# Altium project PUA.PrjPcb (part 10 of 14)

## Sheet Server_CPU_Power.SchDoc
size D
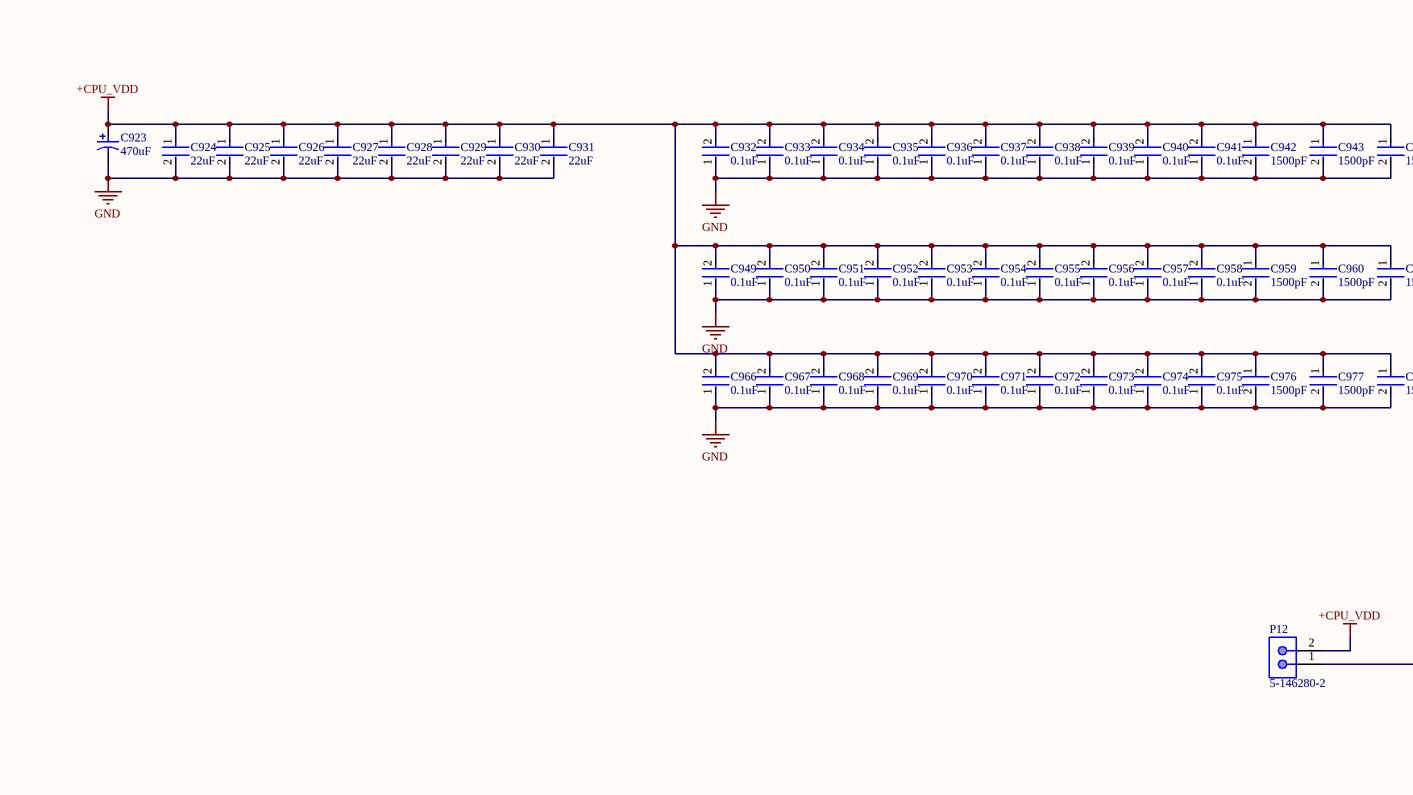
[diagram p45: Server_CPU_Power.SchDoc, top left]
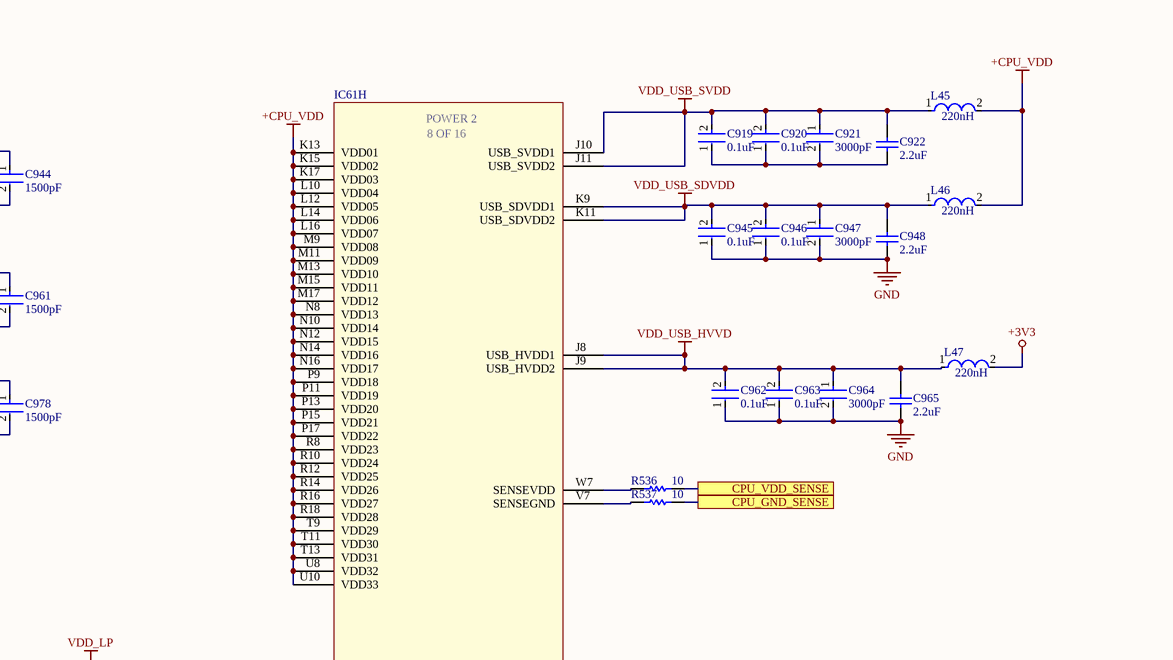
[diagram p46: Server_CPU_Power.SchDoc, top right]
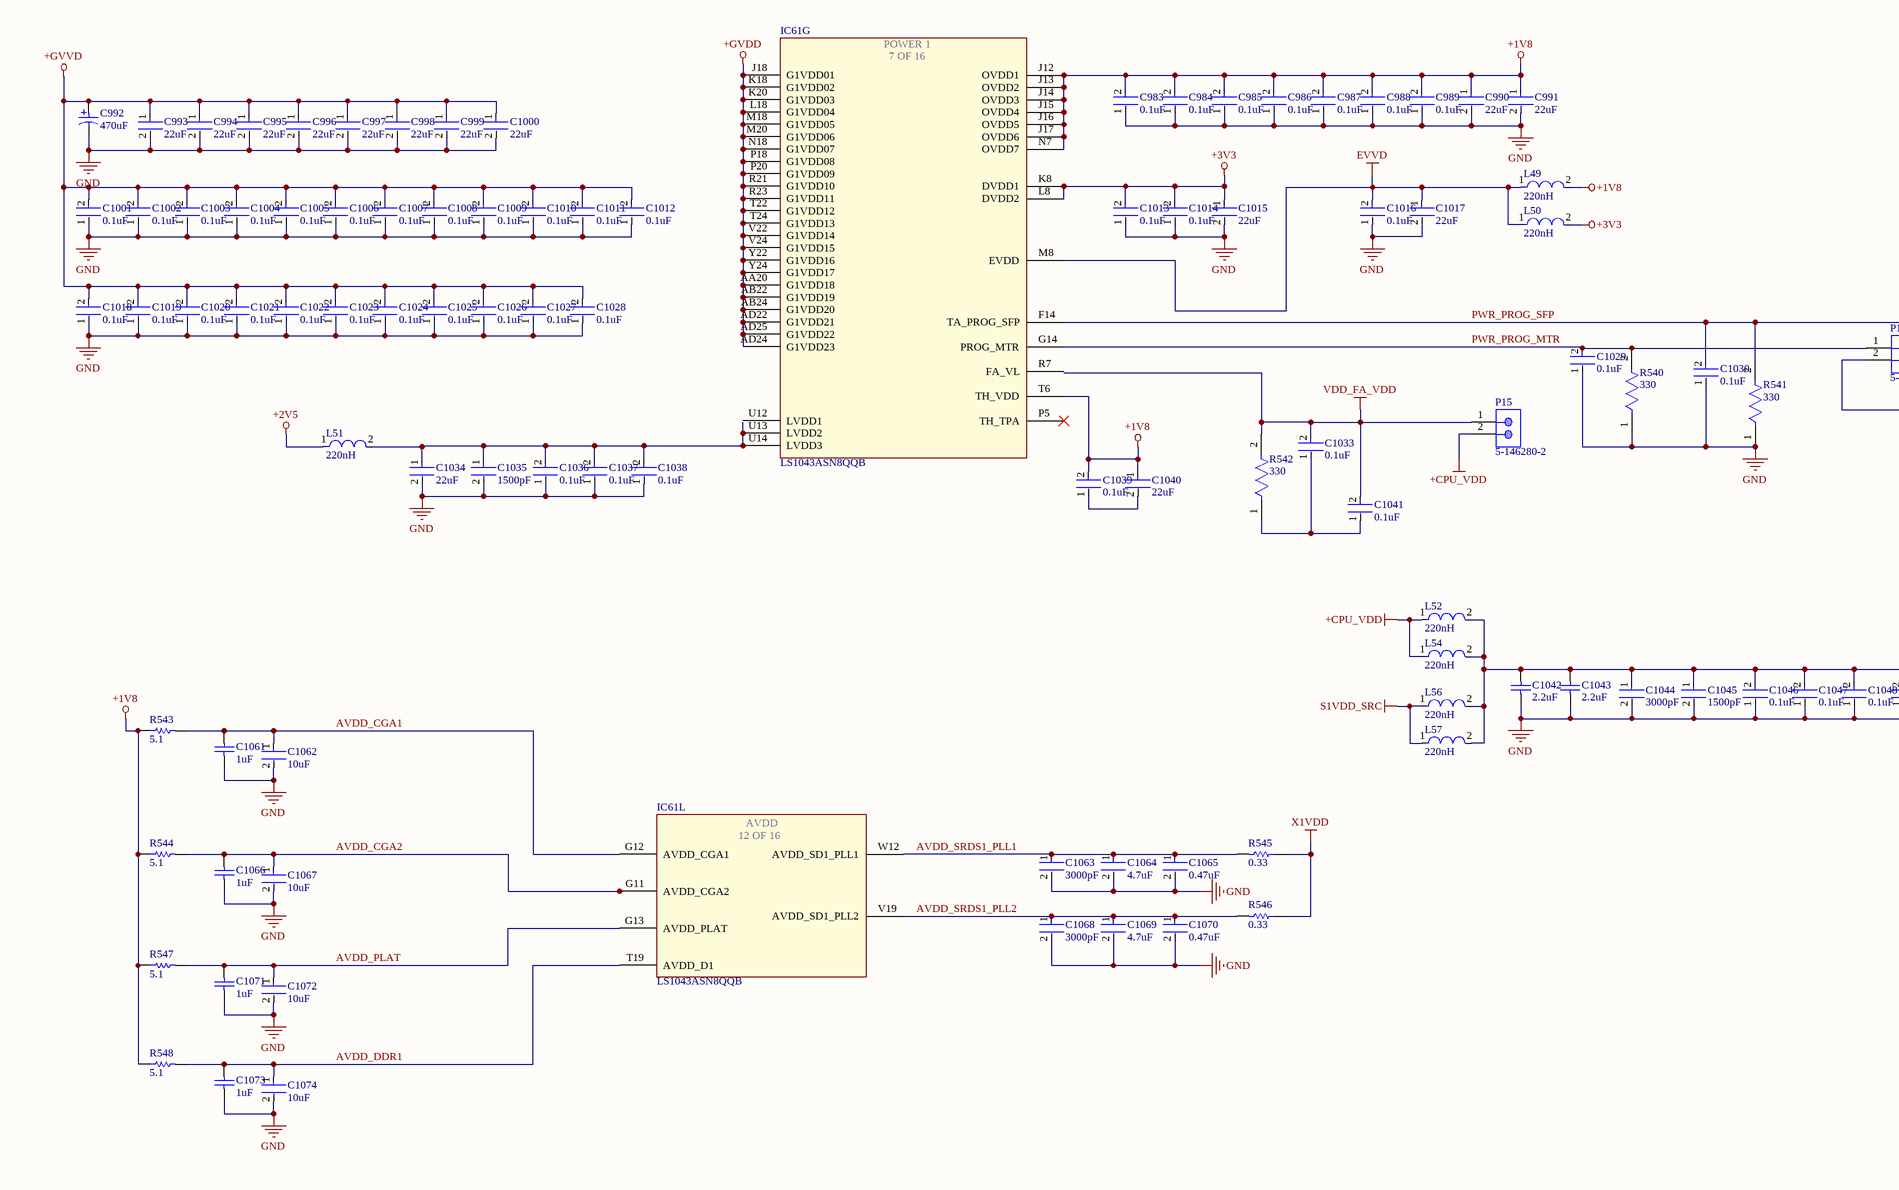
[diagram p47: Server_CPU_Power.SchDoc, bottom left]
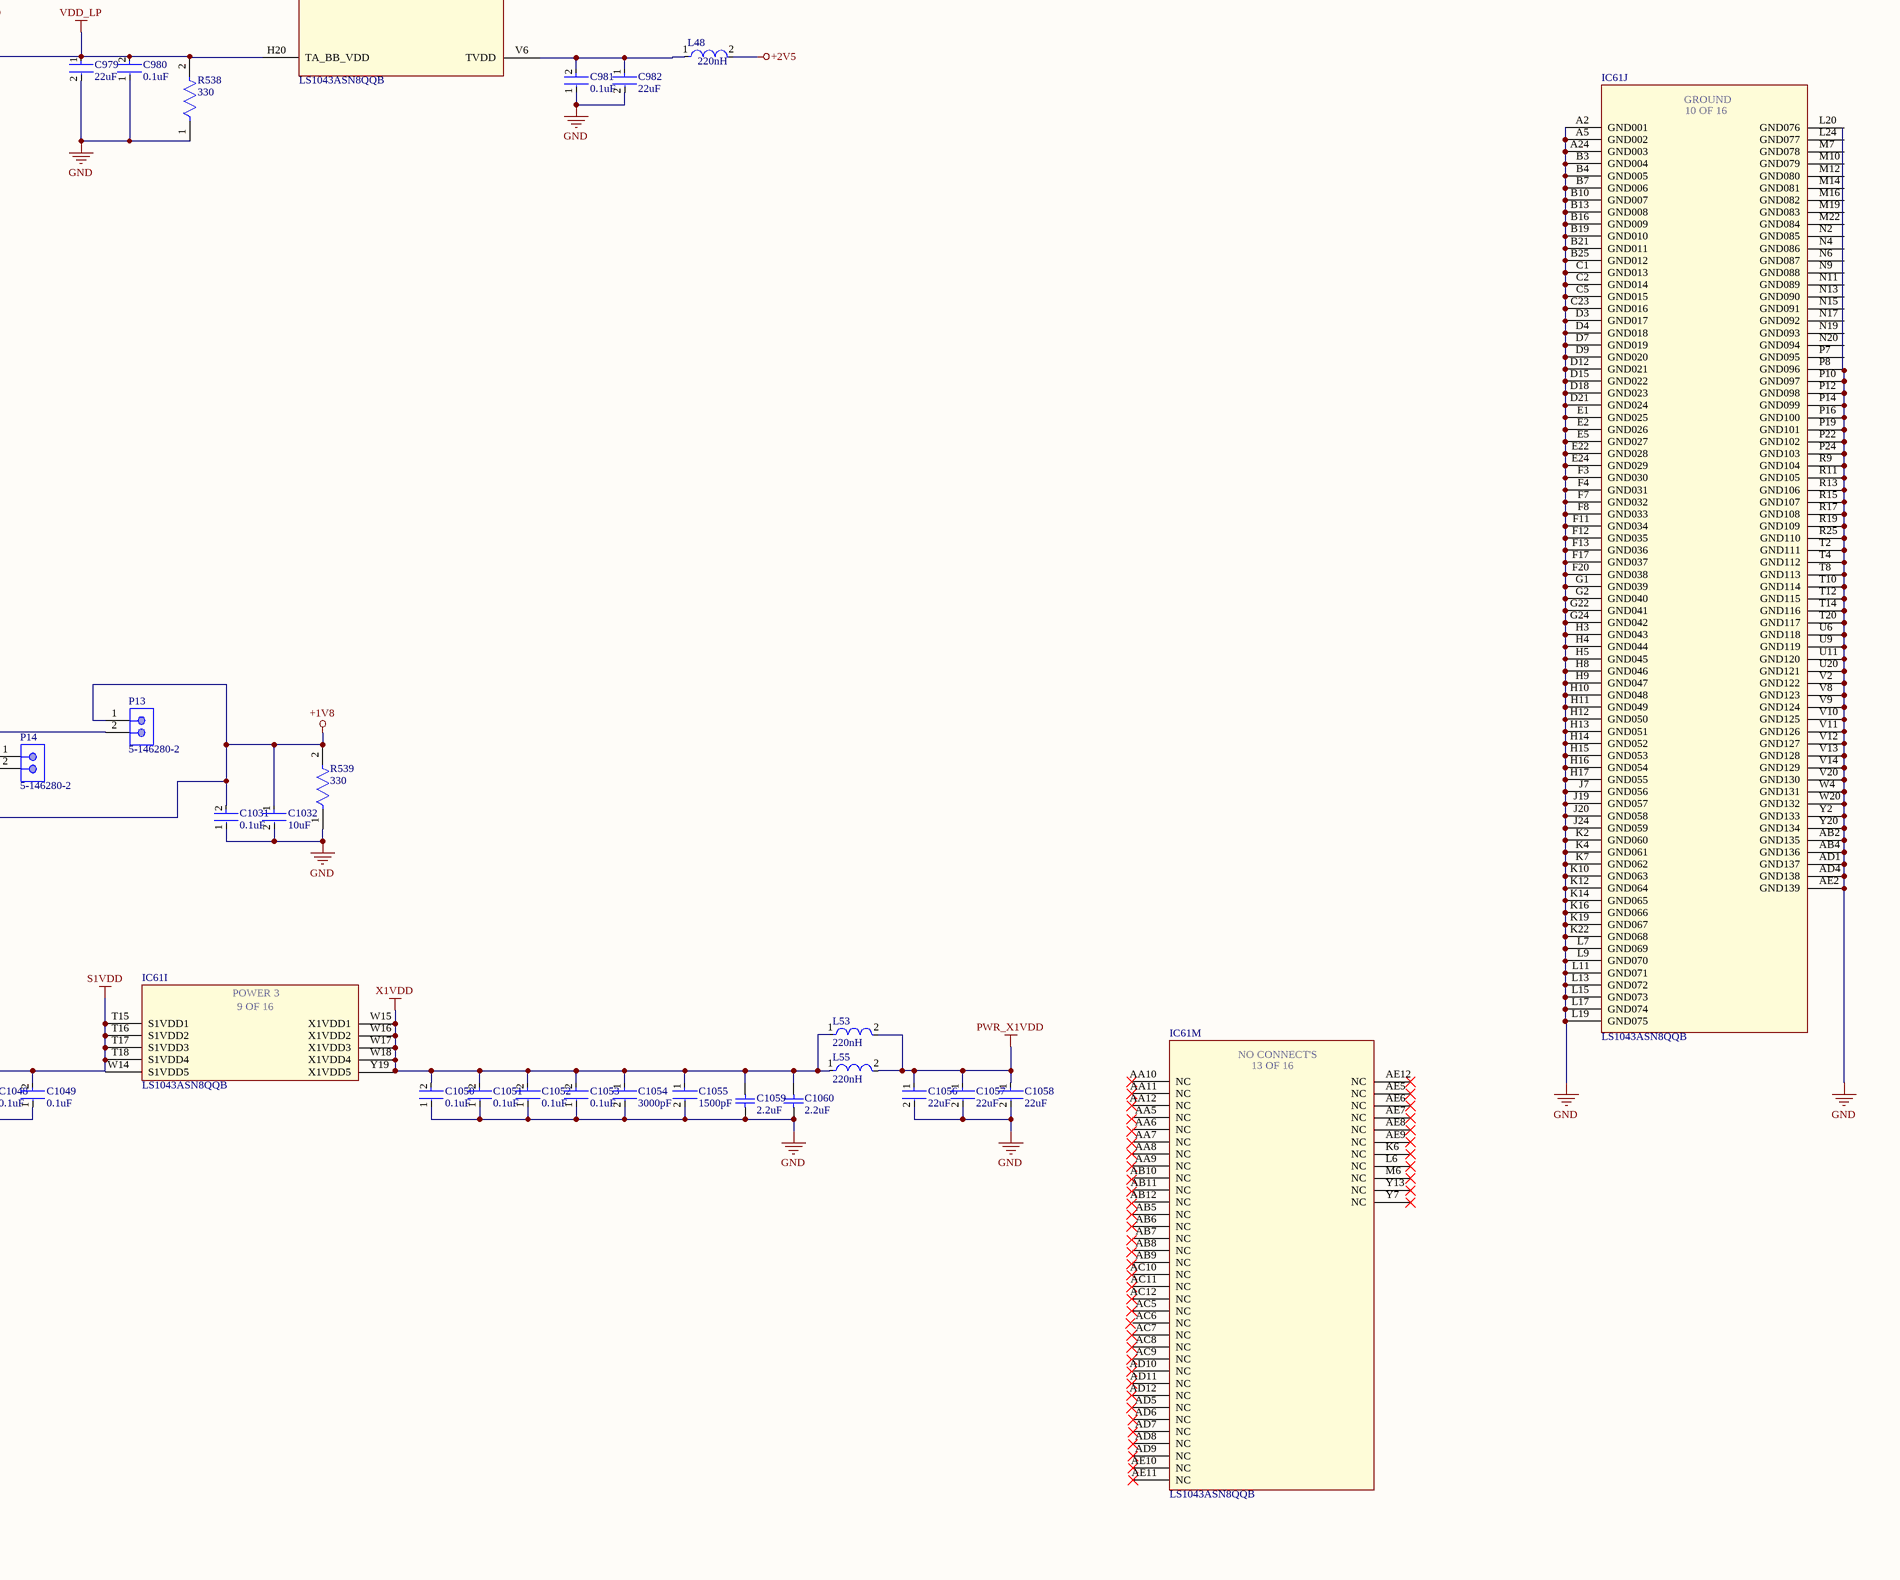
[diagram p48: Server_CPU_Power.SchDoc, bottom right]

### Parts
C919  0.1uF  [FP-GRM15-MFG]
C920  0.1uF  [FP-GRM15-MFG]
C921  3000pF  [FP-GRM155-0_05-IPC_B]
C922  2.2uF  [CAPC1005X55X30NL05T10]
C923  470uF  [PNSC-FK-V-F_V]
C924  22uF  [FP-GRM21B-0_15-MFG]
C925  22uF  [FP-GRM21B-0_15-MFG]
C926  22uF  [FP-GRM21B-0_15-MFG]
C927  22uF  [FP-GRM21B-0_15-MFG]
C928  22uF  [FP-GRM21B-0_15-MFG]
C929  22uF  [FP-GRM21B-0_15-MFG]
C930  22uF  [FP-GRM21B-0_15-MFG]
C931  22uF  [FP-GRM21B-0_15-MFG]
C932  0.1uF  [FP-GRM15-MFG]
C933  0.1uF  [FP-GRM15-MFG]
C934  0.1uF  [FP-GRM15-MFG]
C935  0.1uF  [FP-GRM15-MFG]
C936  0.1uF  [FP-GRM15-MFG]
C937  0.1uF  [FP-GRM15-MFG]
C938  0.1uF  [FP-GRM15-MFG]
C939  0.1uF  [FP-GRM15-MFG]
C940  0.1uF  [FP-GRM15-MFG]
C941  0.1uF  [FP-GRM15-MFG]
C942  1500pF  [FP-C0402-BB-MFG]
C943  1500pF  [FP-C0402-BB-MFG]
C944  1500pF  [FP-C0402-BB-MFG]
C945  0.1uF  [FP-GRM15-MFG]
C946  0.1uF  [FP-GRM15-MFG]
C947  3000pF  [FP-GRM155-0_05-IPC_B]
C948  2.2uF  [CAPC1005X55X30NL05T10]
C949  0.1uF  [FP-GRM15-MFG]
C950  0.1uF  [FP-GRM15-MFG]
C951  0.1uF  [FP-GRM15-MFG]
C952  0.1uF  [FP-GRM15-MFG]
C953  0.1uF  [FP-GRM15-MFG]
C954  0.1uF  [FP-GRM15-MFG]
C955  0.1uF  [FP-GRM15-MFG]
C956  0.1uF  [FP-GRM15-MFG]
C957  0.1uF  [FP-GRM15-MFG]
C958  0.1uF  [FP-GRM15-MFG]
C959  1500pF  [FP-C0402-BB-MFG]
C960  1500pF  [FP-C0402-BB-MFG]
C961  1500pF  [FP-C0402-BB-MFG]
C962  0.1uF  [FP-GRM15-MFG]
C963  0.1uF  [FP-GRM15-MFG]
C964  3000pF  [FP-GRM155-0_05-IPC_B]
C965  2.2uF  [CAPC1005X55X30NL05T10]
C966  0.1uF  [FP-GRM15-MFG]
C967  0.1uF  [FP-GRM15-MFG]
C968  0.1uF  [FP-GRM15-MFG]
C969  0.1uF  [FP-GRM15-MFG]
C970  0.1uF  [FP-GRM15-MFG]
C971  0.1uF  [FP-GRM15-MFG]
C972  0.1uF  [FP-GRM15-MFG]
C973  0.1uF  [FP-GRM15-MFG]
C974  0.1uF  [FP-GRM15-MFG]
C975  0.1uF  [FP-GRM15-MFG]
C976  1500pF  [FP-C0402-BB-MFG]
C977  1500pF  [FP-C0402-BB-MFG]
C978  1500pF  [FP-C0402-BB-MFG]
C979  22uF  [FP-GRM21B-0_15-MFG]
C980  0.1uF  [FP-GRM15-MFG]
C981  0.1uF  [FP-GRM15-MFG]
C982  22uF  [FP-GRM21B-0_15-MFG]
C983  0.1uF  [FP-GRM15-MFG]
C984  0.1uF  [FP-GRM15-MFG]
C985  0.1uF  [FP-GRM15-MFG]
C986  0.1uF  [FP-GRM15-MFG]
C987  0.1uF  [FP-GRM15-MFG]
C988  0.1uF  [FP-GRM15-MFG]
C989  0.1uF  [FP-GRM15-MFG]
C990  22uF  [FP-GRM21B-0_15-MFG]
C991  22uF  [FP-GRM21B-0_15-MFG]
C992  470uF  [PNSC-FK-V-F_V]
C993  22uF  [FP-GRM21B-0_15-MFG]
C994  22uF  [FP-GRM21B-0_15-MFG]
C995  22uF  [FP-GRM21B-0_15-MFG]
C996  22uF  [FP-GRM21B-0_15-MFG]
C997  22uF  [FP-GRM21B-0_15-MFG]
C998  22uF  [FP-GRM21B-0_15-MFG]
C999  22uF  [FP-GRM21B-0_15-MFG]
C1000  22uF  [FP-GRM21B-0_15-MFG]
C1001  0.1uF  [FP-GRM15-MFG]
C1002  0.1uF  [FP-GRM15-MFG]
C1003  0.1uF  [FP-GRM15-MFG]
C1004  0.1uF  [FP-GRM15-MFG]
C1005  0.1uF  [FP-GRM15-MFG]
C1006  0.1uF  [FP-GRM15-MFG]
C1007  0.1uF  [FP-GRM15-MFG]
C1008  0.1uF  [FP-GRM15-MFG]
C1009  0.1uF  [FP-GRM15-MFG]
C1010  0.1uF  [FP-GRM15-MFG]
C1011  0.1uF  [FP-GRM15-MFG]
C1012  0.1uF  [FP-GRM15-MFG]
C1013  0.1uF  [FP-GRM15-MFG]
C1014  0.1uF  [FP-GRM15-MFG]
C1015  22uF  [FP-GRM21B-0_15-MFG]
C1016  0.1uF  [FP-GRM15-MFG]
C1017  22uF  [FP-GRM21B-0_15-MFG]
C1018  0.1uF  [FP-GRM15-MFG]
C1019  0.1uF  [FP-GRM15-MFG]
C1020  0.1uF  [FP-GRM15-MFG]
C1021  0.1uF  [FP-GRM15-MFG]
C1022  0.1uF  [FP-GRM15-MFG]
C1023  0.1uF  [FP-GRM15-MFG]
C1024  0.1uF  [FP-GRM15-MFG]
C1025  0.1uF  [FP-GRM15-MFG]
C1026  0.1uF  [FP-GRM15-MFG]
C1027  0.1uF  [FP-GRM15-MFG]
C1028  0.1uF  [FP-GRM15-MFG]
C1029  0.1uF  [FP-GRM15-MFG]
C1030  0.1uF  [FP-GRM15-MFG]
C1031  0.1uF  [FP-GRM15-MFG]
C1032  10uF  [FP-C0805C-DG-MFG]
C1033  0.1uF  [FP-GRM15-MFG]
C1034  22uF  [FP-GRM21B-0_15-MFG]
C1035  1500pF  [FP-C0402-BB-MFG]
C1036  0.1uF  [FP-GRM15-MFG]
C1037  0.1uF  [FP-GRM15-MFG]
C1038  0.1uF  [FP-GRM15-MFG]
C1039  0.1uF  [FP-GRM15-MFG]
C1040  22uF  [FP-GRM21B-0_15-MFG]
C1041  0.1uF  [FP-GRM15-MFG]
C1042  2.2uF  [CAPC1005X55X30NL05T10]
C1043  2.2uF  [CAPC1005X55X30NL05T10]
C1044  3000pF  [FP-GRM155-0_05-IPC_B]
C1045  1500pF  [FP-C0402-BB-MFG]
C1046  0.1uF  [FP-GRM15-MFG]
C1047  0.1uF  [FP-GRM15-MFG]
C1048  0.1uF  [FP-GRM15-MFG]
C1049  0.1uF  [FP-GRM15-MFG]
C1050  0.1uF  [FP-GRM15-MFG]
C1051  0.1uF  [FP-GRM15-MFG]
C1052  0.1uF  [FP-GRM15-MFG]
C1053  0.1uF  [FP-GRM15-MFG]
C1054  3000pF  [FP-GRM155-0_05-IPC_B]
C1055  1500pF  [FP-C0402-BB-MFG]
C1056  22uF  [FP-GRM21B-0_15-MFG]
C1057  22uF  [FP-GRM21B-0_15-MFG]
C1058  22uF  [FP-GRM21B-0_15-MFG]
C1059  2.2uF  [CAPC1005X55X30NL05T10]
C1060  2.2uF  [CAPC1005X55X30NL05T10]
C1061  1uF  [CAPC1005X60X30LL05T10]
C1062  10uF  [FP-C0805C-DG-MFG]
C1063  3000pF  [FP-GRM155-0_05-IPC_B]
C1064  4.7uF  [FP-GRM188-0_2-IPC_C]
C1065  0.47uF  [FP-GRM188-0_1-e0_2_0_5-IPC_B]
C1066  1uF  [CAPC1005X60X30LL05T10]
C1067  10uF  [FP-C0805C-DG-MFG]
C1068  3000pF  [FP-GRM155-0_05-IPC_B]
C1069  4.7uF  [FP-GRM188-0_2-IPC_C]
C1070  0.47uF  [FP-GRM188-0_1-e0_2_0_5-IPC_B]
C1071  1uF  [CAPC1005X60X30LL05T10]
C1072  10uF  [FP-C0805C-DG-MFG]
C1073  1uF  [CAPC1005X60X30LL05T10]
C1074  10uF  [FP-C0805C-DG-MFG]
IC61  LS1043ASN8QQB  [BGA780C80P28X28_2300X2300X261]  (parts G,H,I,J,L,M of 16)
L45  220nH  [FP-MPLCG0530-MFG]
L46  220nH  [FP-MPLCG0530-MFG]
L47  220nH  [FP-MPLCG0530-MFG]
L48  220nH  [FP-MPLCG0530-MFG]
L49  220nH  [FP-MPLCG0530-MFG]
L50  220nH  [FP-MPLCG0530-MFG]
L51  220nH  [FP-MPLCG0530-MFG]
L52  220nH  [FP-MPLCG0530-MFG]
L53  220nH  [FP-MPLCG0530-MFG]
L54  220nH  [FP-MPLCG0530-MFG]
L55  220nH  [FP-MPLCG0530-MFG]
L56  220nH  [FP-MPLCG0530-MFG]
L57  220nH  [FP-MPLCG0530-MFG]
P12  5-146280-2  [TECO-5-146280-2_V]
P13  5-146280-2  [TECO-5-146280-2_V]
P14  5-146280-2  [TECO-5-146280-2_V]
P15  5-146280-2  [TECO-5-146280-2_V]
R536  10  [RESC1005X40X25NL05T05]
R537  10  [RESC1005X40X25NL05T05]
R538  330  [FP-CRCW0402-e3-MFG]
R539  330  [FP-CRCW0402-e3-MFG]
R540  330  [FP-CRCW0402-e3-MFG]
R541  330  [FP-CRCW0402-e3-MFG]
R542  330  [FP-CRCW0402-e3-MFG]
R543  5.1  [RESC1005X40X25LL05T05]
R544  5.1  [RESC1005X40X25LL05T05]
R545  0.33  [RESC2013X50X40LL20T20]
R546  0.33  [RESC2013X50X40LL20T20]
R547  5.1  [RESC1005X40X25LL05T05]
R548  5.1  [RESC1005X40X25LL05T05]

### Ports
CPU_GND_SENSE, CPU_VDD_SENSE

### Nets
+1V8: C983.2 C984.2 C985.2 C986.2 C987.2 C988.2 C989.2 C990.1 C991.1 C1031.2 C1032.1 C1039.2 C1040.1 IC61.J12(OVDD1) IC61.J13(OVDD2) IC61.J14(OVDD3) IC61.J15(OVDD4) IC61.J16(OVDD5) IC61.J17(OVDD6) IC61.N7(OVDD7) IC61.T6(TH_VDD) L49.2 P13.1 P14.2 R539.2 R543.1 R544.1 R547.1 R548.1
+2V5: L48.2 L51.1
+3V3: C1013.2 C1014.2 C1015.1 IC61.K8(DVDD1) IC61.L8(DVDD2) L47.2 L50.2
+CPU_VDD: C923.1 C924.1 C925.1 C926.1 C927.1 C928.1 C929.1 C930.1 C931.1 C932.2 C933.2 C934.2 C935.2 C936.2 C937.2 C938.2 C939.2 C940.2 C941.2 C942.1 C943.1 C944.1 C949.2 C950.2 C951.2 C952.2 C953.2 C954.2 C955.2 C956.2 C957.2 C958.2 C959.1 C960.1 C961.1 C966.2 C967.2 C968.2 C969.2 C970.2 C971.2 C972.2 C973.2 C974.2 C975.2 C976.1 C977.1 C978.1 IC61.K13(VDD01) IC61.K15(VDD02) IC61.K17(VDD03) IC61.L10(VDD04) IC61.L12(VDD05) IC61.L14(VDD06) IC61.L16(VDD07) IC61.M9(VDD08) IC61.M11(VDD09) IC61.M13(VDD10) IC61.M15(VDD11) IC61.M17(VDD12) IC61.N8(VDD13) IC61.N10(VDD14) IC61.N12(VDD15) IC61.N14(VDD16) IC61.N16(VDD17) IC61.P9(VDD18) IC61.P11(VDD19) IC61.P13(VDD20) IC61.P15(VDD21) IC61.P17(VDD22) IC61.R8(VDD23) IC61.R10(VDD24) IC61.R12(VDD25) IC61.R14(VDD26) IC61.R16(VDD27) IC61.R18(VDD28) IC61.T9(VDD29) IC61.T11(VDD30) IC61.T13(VDD31) IC61.U8(VDD32) IC61.U10(VDD33) L45.2 L46.2 L52.1 L54.1 P12.2 P15.2
+GVDD: IC61.AA20(G1VDD18) IC61.AB22(G1VDD19) IC61.AB24(G1VDD20) IC61.AD22(G1VDD21) IC61.AD24(G1VDD23) IC61.AD25(G1VDD22) IC61.J18(G1VDD01) IC61.K18(G1VDD02) IC61.K20(G1VDD03) IC61.L18(G1VDD04) IC61.M18(G1VDD05) IC61.M20(G1VDD06) IC61.N18(G1VDD07) IC61.P18(G1VDD08) IC61.P20(G1VDD09) IC61.R21(G1VDD10) IC61.R23(G1VDD11) IC61.T22(G1VDD12) IC61.T24(G1VDD13) IC61.V22(G1VDD14) IC61.V24(G1VDD15) IC61.Y22(G1VDD16) IC61.Y24(G1VDD17)
+GVVD: C992.1 C993.1 C994.1 C995.1 C996.1 C997.1 C998.1 C999.1 C1000.1 C1001.2 C1002.2 C1003.2 C1004.2 C1005.2 C1006.2 C1007.2 C1008.2 C1009.2 C1010.2 C1011.2 C1012.2 C1018.2 C1019.2 C1020.2 C1021.2 C1022.2 C1023.2 C1024.2 C1025.2 C1026.2 C1027.2 C1028.2
EVVD: C1016.2 C1017.1 IC61.M8(EVDD) L49.1 L50.1
GND: C923.2 C924.2 C925.2 C926.2 C927.2 C928.2 C929.2 C930.2 C931.2 C932.1 C933.1 C934.1 C935.1 C936.1 C937.1 C938.1 C939.1 C940.1 C941.1 C942.2 C943.2 C944.2 C945.1 C946.1 C947.2 C948.1 C949.1 C950.1 C951.1 C952.1 C953.1 C954.1 C955.1 C956.1 C957.1 C958.1 C959.2 C960.2 C961.2 C962.1 C963.1 C964.2 C965.1 C966.1 C967.1 C968.1 C969.1 C970.1 C971.1 C972.1 C973.1 C974.1 C975.1 C976.2 C977.2 C978.2 C979.2 C980.1 C981.1 C982.2 C983.1 C984.1 C985.1 C986.1 C987.1 C988.1 C989.1 C990.2 C991.2 C992.2 C993.2 C994.2 C995.2 C996.2 C997.2 C998.2 C999.2 C1000.2 C1001.1 C1002.1 C1003.1 C1004.1 C1005.1 C1006.1 C1007.1 C1008.1 C1009.1 C1010.1 C1011.1 C1012.1 C1013.1 C1014.1 C1015.2 C1016.1 C1017.2 C1018.1 C1019.1 C1020.1 C1021.1 C1022.1 C1023.1 C1024.1 C1025.1 C1026.1 C1027.1 C1028.1 C1029.1 C1030.1 C1031.1 C1032.2 C1034.2 C1035.2 C1036.1 C1037.1 C1038.1 C1042.1 C1043.1 C1044.2 C1045.2 C1046.1 C1047.1 C1048.1 C1049.1 C1050.1 C1051.1 C1052.1 C1053.1 C1054.2 C1055.2 C1056.2 C1057.2 C1058.2 C1059.1 C1060.1 C1061.1 C1062.2 C1063.2 C1064.2 C1065.2 C1066.1 C1067.2 C1068.2 C1069.2 C1070.2 C1071.1 C1072.2 C1073.1 C1074.2 IC61.A2(GND001) IC61.A5(GND002) IC61.A24(GND003) IC61.AB2(GND135) IC61.AB4(GND136) IC61.AD1(GND137) IC61.AD4(GND138) IC61.AE2(GND139) IC61.B3(GND004) IC61.B4(GND005) IC61.B7(GND006) IC61.B10(GND007) IC61.B13(GND008) IC61.B16(GND009) IC61.B19(GND010) IC61.B21(GND011) IC61.B25(GND012) IC61.C1(GND013) IC61.C2(GND014) IC61.C5(GND015) IC61.C23(GND016) IC61.D3(GND017) IC61.D4(GND018) IC61.D7(GND019) IC61.D9(GND020) IC61.D12(GND021) IC61.D15(GND022) IC61.D18(GND023) IC61.D21(GND024) IC61.E1(GND025) IC61.E2(GND026) IC61.E5(GND027) IC61.E22(GND028) IC61.E24(GND029) IC61.F3(GND030) IC61.F4(GND031) IC61.F7(GND032) IC61.F8(GND033) IC61.F11(GND034) IC61.F12(GND035) IC61.F13(GND036) IC61.F17(GND037) IC61.F20(GND038) IC61.G1(GND039) IC61.G2(GND040) IC61.G22(GND041) IC61.G24(GND042) IC61.H3(GND043) IC61.H4(GND044) IC61.H5(GND045) IC61.H8(GND046) IC61.H9(GND047) IC61.H10(GND048) IC61.H11(GND049) IC61.H12(GND050) IC61.H13(GND051) IC61.H14(GND052) IC61.H15(GND053) IC61.H16(GND054) IC61.H17(GND055) IC61.J7(GND056) IC61.J19(GND057) IC61.J20(GND058) IC61.J24(GND059) IC61.K2(GND060) IC61.K4(GND061) IC61.K7(GND062) IC61.K10(GND063) IC61.K12(GND064) IC61.K14(GND065) IC61.K16(GND066) IC61.K19(GND067) IC61.K22(GND068) IC61.L7(GND069) IC61.L9(GND070) IC61.L11(GND071) IC61.L13(GND072) IC61.L15(GND073) IC61.L17(GND074) IC61.L19(GND075) IC61.P8(GND096) IC61.P10(GND097) IC61.P12(GND098) IC61.P14(GND099) IC61.P16(GND100) IC61.P19(GND101) IC61.P22(GND102) IC61.P24(GND103) IC61.R9(GND104) IC61.R11(GND105) IC61.R13(GND106) IC61.R15(GND107) IC61.R17(GND108) IC61.R19(GND109) IC61.R25(GND110) IC61.T2(GND111) IC61.T4(GND112) IC61.T8(GND113) IC61.T10(GND114) IC61.T12(GND115) IC61.T14(GND116) IC61.T20(GND117) IC61.U6(GND118) IC61.U9(GND119) IC61.U11(GND120) IC61.U20(GND121) IC61.V2(GND122) IC61.V8(GND123) IC61.V9(GND124) IC61.V10(GND125) IC61.V11(GND126) IC61.V12(GND127) IC61.V13(GND128) IC61.V14(GND129) IC61.V20(GND130) IC61.W4(GND131) IC61.W20(GND132) IC61.Y2(GND133) IC61.Y20(GND134) R538.1 R539.1 R540.1 R541.1
PWR_X1VDD: C1056.1 C1057.1 C1058.1 L53.2 L55.2
S1VDD: C1042.2 C1043.2 C1044.1 C1045.1 C1046.2 C1047.2 C1048.2 C1049.2 IC61.T15(S1VDD1) IC61.T16(S1VDD2) IC61.T17(S1VDD3) IC61.T18(S1VDD4) L52.2 L54.2 L56.2 L57.2
S1VDD_SRC: L56.1 L57.1
VDD_FA_VDD: C1033.2 C1041.2 P15.1 R542.2
VDD_LP: C979.1 C980.2 IC61.H20(TA_BB_VDD) P12.1 R538.2
VDD_USB_HVVD: C962.2 C963.2 C964.1 C965.2 IC61.J8(USB_HVDD1) IC61.J9(USB_HVDD2) L47.1
VDD_USB_SDVDD: C945.2 C946.2 C947.1 C948.2 IC61.K9(USB_SDVDD1) IC61.K11(USB_SDVDD2) L46.1
VDD_USB_SVDD: C919.2 C920.2 C921.1 C922.2 IC61.J10(USB_SVDD1) IC61.J11(USB_SVDD2) L45.1
X1VDD: C1050.2 C1051.2 C1052.2 C1053.2 C1054.1 C1055.1 C1059.2 C1060.2 IC61.W15(X1VDD1) IC61.W16(X1VDD2) IC61.W17(X1VDD3) IC61.W18(X1VDD4) IC61.Y19(X1VDD5) L53.1 L55.1 R545.1 R546.1
AVDD_CGA1: C1061.2 C1062.1 IC61.G12(AVDD_CGA1) R543.2
AVDD_CGA2: C1066.2 C1067.1 IC61.G11(AVDD_CGA2) R544.2
AVDD_DDR1: C1073.2 C1074.1 IC61.T19(AVDD_D1) R548.2
AVDD_PLAT: C1071.2 C1072.1 IC61.G13(AVDD_PLAT) R547.2
AVDD_SRDS1_PLL1: C1063.1 C1064.1 C1065.1 IC61.W12(AVDD_SD1_PLL1) R545.2
AVDD_SRDS1_PLL2: C1068.1 C1069.1 C1070.1 IC61.V19(AVDD_SD1_PLL2) R546.2
PWR_PROG_MTR: C1029.2 IC61.G14(PROG_MTR) P14.1 R540.2
PWR_PROG_SFP: C1030.2 IC61.F14(TA_PROG_SFP) P13.2 R541.2
NetC919_1: C919.1 C920.1 C921.2 C922.1
NetC981_2: C981.2 C982.1 IC61.V6(TVDD) L48.1
NetC1033_1: C1033.1 C1041.1 R542.1
NetC1034_1: C1034.1 C1035.1 C1036.2 C1037.2 C1038.2 IC61.U13(LVDD2) IC61.U14(LVDD3) L51.2
NetC1039_1: C1039.1 C1040.2
NetIC61_V7: IC61.V7(SENSEGND) R537.1
NetIC61_W7: IC61.W7(SENSEVDD) R536.1
NetR536_2: R536.2 ; port CPU_VDD_SENSE
NetR537_2: R537.2 ; port CPU_GND_SENSE

Not connected (* = marked no-connect by the designer): IC61 AA5(NC) AA6(NC) AA7(NC) AA8(NC) AA9(NC) AA10(NC) AA11(NC) AA12(NC) AB5(NC) AB6(NC) AB7(NC) AB8(NC) AB9(NC) AB10(NC) AB11(NC) AB12(NC) AC5(NC) AC6(NC) AC7(NC) AC8(NC) AC9(NC) AC10(NC) AC11(NC) AC12(NC) AD5(NC) AD6(NC)* AD7(NC)* AD8(NC)* AD9(NC)* AD10(NC) AD11(NC) AD12(NC) AE5(NC)* AE6(NC)* AE7(NC)* AE8(NC)* AE9(NC)* AE10(NC)* AE11(NC)* AE12(NC)* K6(NC)* L6(NC)* L20(GND076) L24(GND077) M6(NC)* M7(GND078) M10(GND079) M12(GND080) M14(GND081) M16(GND082) M19(GND083) M22(GND084) N2(GND085) N4(GND086) N6(GND087) N9(GND088) N11(GND089) N13(GND090) N15(GND091) N17(GND092) N19(GND093) N20(GND094) P5(TH_TPA)* P7(GND095) R7(FA_VL) U12(LVDD1) W14(S1VDD5) Y7(NC)* Y13(NC)*

### Notes on the sheet
- Title
- Size:
- Date:
- File:
- D
- Number:
- Time:
- Revision:
- Sheet
- of
- (in symbol LS1043ASN8QQB, part G) POWER 1; 7 OF 16
- (in symbol LS1043ASN8QQB, part H) POWER 2; 8 OF 16
- (in symbol LS1043ASN8QQB, part I) POWER 3; 9 OF 16
- (in symbol LS1043ASN8QQB, part J) GROUND; 10 OF 16
- (in symbol LS1043ASN8QQB, part L) AVDD; 12 OF 16
- (in symbol LS1043ASN8QQB, part M) NO CONNECT'S; 13 OF 16

### Library data of the parts
C919 C920 C932-C941 C945 C946 C949-C958 C962 C963 C966-C975 C980 C981 C983-C989 C1001-C1014 C1016 C1018-C1031 C1033 C1036-C1039 C1041 C1046-C1053 = CMP-2100-03641-2: as C725 on sheet Private_CPU_DDR4; RoHS: TRUE; Temperature Characteristic: X7R; Octopart: https://octopart.com/grm155r71c104ka88d-murata-196880; Digikey Description: CAP CER 0.1UF 16V X7R 0402; Device Class L3: Ceramic Capacitors; Height: 0.55mm; ComponentLink2Description: Datasheet; Temperature Range Low: -55°C; Ipc Land Pattern Name: CAPC10050X219; ComponentLink2URL: https://search.murata.co.jp/Ceramy/image/img/A01X/G101/ENG/GRM155R71H471KA01-01A.pdf; Device Class L1: Passive Components; Lead Free: yes; Category: Cap; Package: GRM15; Temperature: -55°C to +125°C; Device Class L2: Capacitors; Temperature Range High: +125°C; Mouser Description: 0402 0.1 uF 16V ±10 % Tolerance X7R SMT Multilayer Ceramic Capacitor
C921 C947 C964 C1044 C1054 C1063 C1068 = CMP-2008-04488-2: Chip Multilayer Ceramic Capacitors for General Purpose, 0402, 3000pF, U2J, -750ppm/°C, 5%, 10V; Capacitance: 3nF; Termination: SMD/SMT; Case Code (Imperial): 0402; Radiation Hardening: No; Mount: Surface Mount; Tolerance: 5%; Packaging: Tape and Reel; Thickness: 0.022inch; Max Operating Temperature: 125°C; Length: 1mm; Min Operating Temperature: -55°C; Voltage Rating (DC): 10V; Dielectric: U2J; Depth: 0.5mm; Lead Free: Lead Free; Width: 0.5mm; Package Quantity: 10000; Height: 0.5mm; Case Code (Metric): 1005; Voltage Rating: 10V; Case/Package: 0402
C922 C948 C965 C1042 C1043 C1059 C1060 = CMP-2008-02064-2: Manufacturer: Kemet; Part Number: C0402C225M9PACTU
C923 C992 = CMP-2000-06204-1: Aluminum Electrolytic Capacitor, 470 uF, +/- 20%, 16 V, 2-Pin SMD (Size Code F), -55 to 105 degC, RoHS, Tape and Reel; Manufacturer: Panasonic; Capacitance: 470µF; Type: Can; Ripple Current: 600mA; Lifetime@Temperature: 2000Hrs@105°C; Impedance: 0.16O; Rated Voltage: 16V; Manufacturer URL: http://www.panasonic.com/; Package Description: 2-Pin Electrolytic Aluminum Capacitor, Body 8.3 x 8.3 mm; Operating Temp-Max: 105°C; Mounting Technology: SurfaceMount; Operating Temp Range: -55to+105°C; Datasheet Version: 03/2016; Series: FK; Package Reference: FK-V-F; Case Size/Dimension: Ø8x10.2mm; Package URL: http://industrial.panasonic.com/cdbs/www-data/pdf/RDE0000/DME0000COL48.pdf; Datasheet URL: http://industrial.panasonic.com/cdbs/www-data/pdf/RDE0000/ABA0000C1181.pdf
C924-C931 C979 C982 C990 C991 C993-C1000 C1015 C1017 C1034 C1040 C1056-C1058 = CMP-2007-03385-2: as C889-C898 on sheet Private_CPU_Sub_Power_Supplies; Material: Ceramic; Max Operating Temperature: 85°C; Voltage: 6.3V; Min Operating Temperature: -55°C; Case/Package: 0805; Thickness: 0.053inch; Dielectric: X5R; Packaging: Tape and Reel; Depth: 1.25mm; Termination: SMD/SMT; Voltage Rating (DC): 6.3V; Radiation Hardening: No; Tolerance: 20%; Mount: Surface Mount; Lead Free: Lead Free; Package Quantity: 1; REACH SVHC: No SVHC; Voltage Rating: 6.3V; Capacitance: 22uF; Length: 2mm; Case Code (Imperial): 0805; Case Code (Metric): 2012; Width: 0.049inch; Height: 1.25mm
C942-C944 C959-C961 C976-C978 C1035 C1045 C1055 = CMP-2008-03108-2: CAP CER 1500PF 50V X7R 0402; Manufacturer Part Number: C0402C152K5RACTU; Manufacturer: Kemet; Value: 1,500 pF; Material: Ceramic; Tolerance: 0.1; Temperature Coefficient: 15%; Automotive: No; Octopart: https://octopart.com/c0402c152k5ractu-kemet-125298; Device Class L3: Ceramic Capacitors; Device Class L2: Capacitors; Mouser Description: Multilayer Ceramic Capacitors MLCC - SMD/SMT 50volts 1500pF X7R 10%; Temperature Range High: +125°C; ComponentLink2URL: https://content.kemet.com/datasheets/KEM_C1002_X7R_SMD.pdf; ComponentLink2Description: Datasheet; RoHS: TRUE; Temperature: -55°C to +125°C; Height: 0.55mm; Device Class L1: Passive Components; Voltage Rating: 50 V; Lead Free: Yes; Temperature Characteristic: X7R; Temperature Range Low: -55°C; Capacitance: 1,500 pF; Package: C0402-BB; Category: Cap; Digikey Description: CAP CER 1500PF 50V X7R 0402; Ipc Land Pattern Name: CAPC10050X50
C1032 C1062 C1067 C1072 C1074 = CMP-2007-03243-2: CAP CER 10UF 10V X5R 0805; Manufacturer Part Number: C0805C106K8PACTU; Manufacturer: Kemet; 3DS Part Number: 220-00001; Tolerance: 10%; Temperature Coefficient: 15%; Material: Ceramic; Device Class L2: Capacitors; Device Class L1: Passive Components; ComponentLink2URL: https://content.kemet.com/datasheets/KEM_C1006_X5R_SMD.pdf; Height: 1.4mm; Lead Free: Yes; Digikey Description: CAP CER 10UF 10V X5R 0805; Octopart: https://octopart.com/c0805c106k8pactu-kemet-98697; Capacitance: 10uF; Value: 10uF; Temperature Range Low: -55°C; Temperature: -55°C to +85°C; Automotive: No; Mouser Description: CAP CER 10UF 10V X5R 0805; Ipc Land Pattern Name: CAPC200125X125; Temperature Range High: +85°C; Voltage: 10V; RoHS: TRUE; Device Class L3: Ceramic Capacitors; ComponentLink2Description: Datasheet; Voltage Rating: 10V; Package: C0805C-DG; Temperature Characteristic: X5R; Category: Cap
C1061 C1066 C1071 C1073 = CMP-2008-02081-1: Part Number: C0402C105K8PAC7867; Manufacturer: Kemet
C1064 C1069 = CMP-2006-02545-2: Chip Multilayer Ceramic Capacitors for General Purpose, 0603, 4.7uF, X5R, 15%, 10%, 35V; Lead Free: Lead Free; Max Operating Temperature: 85°C; Case Code (Imperial): 0603; Capacitance: 4.7uF; Width: 0.8mm; Thickness: 0.031inch; Case Code (Metric): 1608; Min Operating Temperature: -55°C; Voltage Rating (DC): 35V; Dielectric: X5R; Voltage: 35V; Packaging: Tape and Reel; Resistor Type: Ceramic; Weight: 0.000222oz; Mount: Surface Mount; Material: Ceramic; Depth: 0.8mm; Tolerance: 10%; REACH SVHC: No SVHC; Case/Package: 0603; Voltage Rating: 35V; Package Quantity: 4000; Height: 0.8mm; Length: 1.6mm; Termination: SMD/SMT
C1065 C1070 = CMP-2006-02860-2: as C873-C875 on sheet Private_CPU_Sub_Power_Supplies; Material: Ceramic; Termination: SMD/SMT; Case Code (Imperial): 0603; Height: 0.8mm; Dielectric: X7R; Length: 1.6mm; Packaging: Tape and Reel; Mount: Surface Mount; Thickness: 0.035inch; Voltage Rating (DC): 16V; Case Code (Metric): 1608; REACH SVHC: No SVHC; Depth: 0.8mm; Number of Pins: 2; Max Operating Temperature: 125°C; Min Operating Temperature: -55°C; Width: 0.8mm; Voltage: 16V; Lead Free: Lead Free; Voltage Rating: 16V; Package Quantity: 1; Case/Package: 0603; Tolerance: 10%
IC61 = LS1043ASN8QQB: as IC30 on sheet Private_CPU_DDR4; Datasheet Link: http://www.nxp.com/secured/assets/documents/en/data-sheet/LS1088A.pdf; Height: 2.61mm; Manufacturer_Part_Number: LS1043ASN8QQB; Mouser Part Number: 771-LS1043ASN8QQB; Mouser Price/Stock: https://www.mouser.co.uk/ProductDetail/NXP-Semiconductors/LS1043ASN8QQB/?qs=AQlKX63v8RsTATOTx7X0Jg%3D%3D
L45-L57 = CMP-03027-000001-1: FIXED IND 220NH 14.1A 3.7 MOHM; Manufacturer: KEMET; Manufacturer Part Number: MPLCG0530LR22; Shielding: true; Saturation Current: 10.2A; Series Resistance: 3.7mΩ; Value: 0.22uH; Standoff Height: 0.1mm; Core Material: Metal Composite; Tolerance: 20%; Test Frequency: 100kHz; Octopart: https://octopart.com/mplcg0530lr22-kemet-30531716; Composition: Wirewound; Height: 3mm; Device Class L2: Inductors; Rms Current: 14.1A; Digikey Description: FIXED IND 220NH 14.1A 3.7 MOHM; Package: MPLCG0530; ComponentLink2Description: Datasheet; Automotive: No; Inductance: 0.22uH; ComponentLink2URL: https://content.kemet.com/datasheets/KEM_L9005_MPLCG.pdf; Temperature Range High: +125°C; RoHS: TRUE; Device Class L3: Fixed Inductors; Temperature Range Low: -40°C; Category: Ind; Device Class L1: Passive Components; Lead Free: Yes; Mouser Description: Fixed Inductors 0.22uH 20% SMD; Temperature: -40°C to +125°C
P12-P15 = CMP-2000-07492-1: Male Header, Pitch 2.54 mm, 1 x 2 Position, Height 8.21 mm, Tail Length 3.05 mm, -65 to 105 degC, RoHS, Bulk; Manufacturer: TE Connectivity; Mating Connector Lock: No(Without); Number of Positions: 2; Pitch: 2.54mm; PCB Mounting Orientation: Vertical; Keyed: No; Case\/Package: 100; Mating Post Length: 0.23inch; High Temperature Housing: Yes; Max Current Rating: 5A; PCB Thickness: 0.063inch; PCB Mount Retention: Without; Approvals: CSA; Current Rating: 3A; Radiation Hardening: No; Length: 4.67mm; Contact Mating Length: 0.23inch; Connector Type: Header; Number of Rows: 1; Termination Post Length: 0.12inch; Board Standoff: No(Without); Max Operating Temperature: 105degC; Contact Shape: Square; Selectively Loaded: No(Without); Gasket: No(Without); Number of Contacts: 2; Contact Gender: Male; Mating Alignment: No(Without); Manufacturer URL: http://www.te.com/; Datasheet URL: http://www.te.com/commerce/DocumentDelivery/DDEController?Action=showdoc&DocId=Customer+Drawing%7F146280%7FH1%7Fpdf%7FEnglish%7FENG_CD_146280_H1.pdf%7F5-146280-2; Mount: ThroughHole; Orientation: Straight; Packaging: Carton; Package Reference: 5-146280-2; Package Quantity: 500; Stabilizers: No(Without); Row Spacing: 2.54mm; Contact Material: CopperAlloy; Panel Mount Retention: No(Without); Datasheet Version: Rev. H1, 08/2016; Housing Colour: Black; Colour: Black; Package Description: Male Header, Pitch 2.54 mm, 1 x 2 Position, Height 8.21 mm, Tail Length 3.05 mm; Contact Plating: Matte; Housing Material: Polymer; Contact Protection: No(Without); Min Operating Temperature: -65degC; Mounting Technology: ThroughHole; Flammability Rating: UL94V-0; RoHSCompliant: true; Termination: ThroughHole; Depth: 2.34mm; High Speed Serial Data Connector: No
R536 R537 = CMP-2002-08143-1: Part Number: CRCW040210R0FKED; Manufacturer: Vishay Dale
R538-R542 = CMP-2002-08523-2: RES Thick Film, 330Ω, 1%, 0.063W, 100ppm/°C, 0402; Max Power Dissipation: 63mW; Voltage Rating (DC): 50V; Resistance: 330R; Case/Package: 0402; Packaging: Tape and Reel; Width: 0.5mm; Case Code (Metric): 1005; Radiation Hardening: No; Military Standard: Not; Contact Plating: Tin; Temperature Coefficient: 100ppm/°C; Lead Free: Lead Free; Power Rating: 63mW; Voltage Rating: 50V; Tolerance: 1%; Features: Automotive AEC-Q200; Case Code (Imperial): 0402; Composition: Thick Film; Weight: 2.3E-05oz; Package Quantity: 10; Min Operating Temperature: -55°C; Height: 0.35mm; Length: 1mm; Termination: SMD/SMT; Number of Terminations: 2; Depth: 0.5mm; Max Operating Temperature: 155°C
R543 R544 R547 R548 = CMP-1011-00251-2: Part Number: CRCW04025R10FKED; Manufacturer: Vishay Dale
R545 R546 = CMP-2001-03204-1: Manufacturer: Susumu; Part Number: RP2012T-R33-F